# EAGLE design usbdmx (EAGLE 7.2.0)
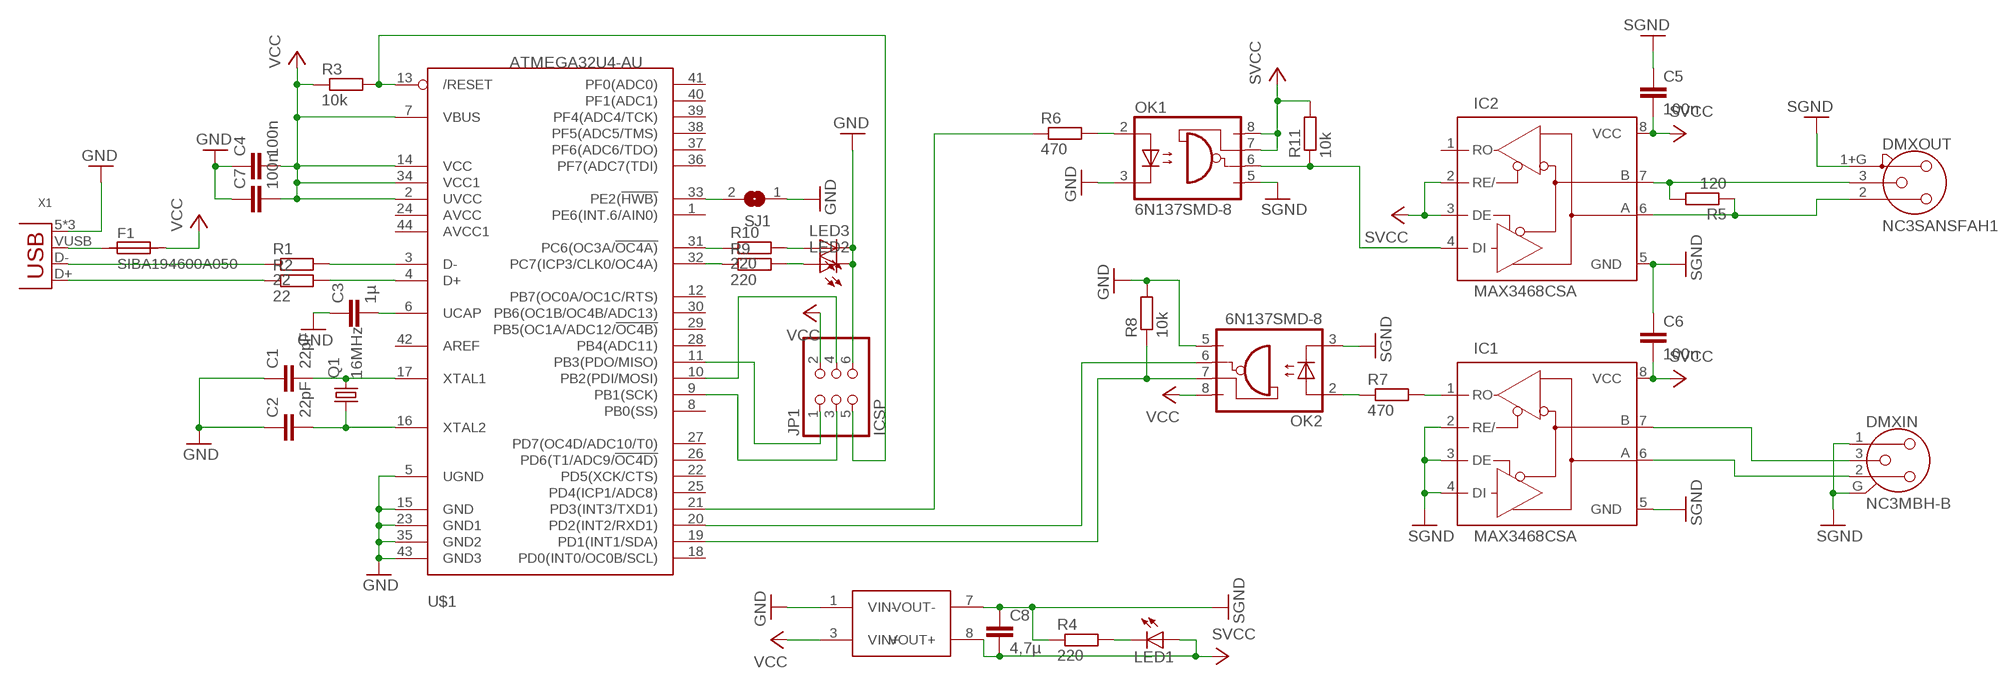
[diagram p0: schematic, sheet 1]

## Parts
C1  22pF  C-EUC0805  [C0805]
C2  22pF  C-EUC0805  [C0805]
C3  1µ  C-EUC0805  [C0805]
C4  100n  C-EUC0805  [C0805]
C5  100n  C-EUC0805  [C0805]
C6  100n  C-EUC0805  [C0805]
C7  100n  C-EUC0805  [C0805]
C8  4,7µ  C-EUC0805  [C0805]
DMXIN  NC3MBH-B  [NC3MBH-B]
DMXOUT  NC3SANSFAH1  [NC3FAH1]
F1  SIBA194600A050  [1820]
IC1  MAX3468CSA  [SO08]
IC2  MAX3468CSA  [SO08]
JP1  ICSP  PINHD-2X3_2.54-SMD  [2X03SMD]
LED1  LEDSML0603  [SML0603]
LED2  LEDSML0603  [SML0603]
LED3  LEDSML0603  [SML0603]
OK1  6N137SMD-8  [SMD8]
OK2  6N137SMD-8  [SMD8]
Q1  16MHz  CRYSTALMT  [MT]
R1  22  R-EU_R0805  [R0805]
R2  22  R-EU_R0805  [R0805]
R3  10k  R-EU_R0805  [R0805]
R4  220  R-EU_R0805  [R0805]
R5  120  R-EU_R0805  [R0805]
R6  470  R-EU_R0805  [R0805]
R7  470  R-EU_R0805  [R0805]
R8  10k  R-EU_R0805  [R0805]
R9  220  R-EU_R0805  [R0805]
R10  220  R-EU_R0805  [R0805]
R11  10k  R-EU_R0805  [R0805]
SJ1  SJ  [SJ]
U$1  ATMEGA32U4-AU  [TQFP44]
U$2  NTE0505SNTE0505MEC  [SMT]
X1  USB-B-S-R  [USB-B-SMT-R]

## Nets
GND: C1.1 C2.1 C3.1 C4.1 C7.1 JP1.6 LED2.C LED3.C OK1.3(C) OK2.5(GND) R8.2 SJ1.1 U$1.5(UGND) U$1.15(GND) U$1.23(GND1) U$1.35(GND2) U$1.43(GND3) U$2.1(VIN-) X1.5(GND) X1.6(GND) X1.GND
N$1: C1.2 Q1.P3 U$1.17(XTAL1)
N$2: C2.2 Q1.P1 U$1.16(XTAL2)
N$3: R1.2 U$1.3(D-)
N$4: R2.2 U$1.4(D+)
N$5: R2.1 X1.D+
N$6: R1.1 X1.D-
N$7: F1.1 X1.VUSB(VBUS)
N$8: C3.2 U$1.6(UCAP)
N$9: JP1.5 R3.2 U$1.13(/RESET)
N$10: R6.1 U$1.21(PD3(INT3/TXD1))
N$11: LED1.C R4.2
N$12: DMXOUT.2 IC2.6(A) R5.1
N$13: JP1.1 U$1.11(PB3(PDO/MISO))
N$14: JP1.4 U$1.10(PB2(PDI/MOSI))
N$15: JP1.3 U$1.9(PB1(SCK))
N$16: OK2.7(VE) R8.1 U$1.19(PD1(INT1/SDA))
N$17: DMXOUT.3 IC2.7(B) R5.2
N$18: DMXIN.2 IC1.6(A)
N$19: SJ1.2 U$1.33(PE2(!HWB))
N$20: IC2.4(DI) OK1.6(VO) R11.1
N$21: IC1.1(RO) R7.2
N$22: LED3.A R10.2
N$23: OK2.2(A) R7.1
N$24: OK2.6(VO) U$1.20(PD2(INT2/RXD1))
N$25: OK1.2(A) R6.2
N$26: LED2.A R9.2
N$27: R9.1 U$1.32(PC7(ICP3/CLK0/OC4A))
N$28: R10.1 U$1.31(PC6(OC3A/!OC4A))
N$29: DMXIN.3 IC1.7(B)
SGND: C5.1 C6.1 C8.1 DMXIN.1 DMXIN.G DMXOUT.1+G IC1.2(RE/) IC1.3(DE) IC1.4(DI) IC1.5(GND) IC2.5(GND) OK1.5(GND) OK2.3(C) R4.1 U$2.7(VOUT-)
SVCC: C5.2 C6.2 C8.2 IC1.8(VCC) IC2.2(RE/) IC2.3(DE) IC2.8(VCC) LED1.A OK1.7(VE) OK1.8(VCC) R11.2 U$2.8(VOUT+)
VCC: C4.2 C7.2 F1.2 JP1.2 OK2.8(VCC) R3.1 U$1.2(UVCC) U$1.7(VBUS) U$1.14(VCC) U$1.34(VCC1) U$2.3(VIN+)
Unconnected: IC2.1(RO) Q1.P2(GND) Q1.P4(GND1) U$1.1(PE6(INT.6/AIN0)) U$1.8(PB0(SS)) U$1.12(PB7(OC0A/OC1C/RTS)) U$1.18(PD0(INT0/OC0B/SCL)) U$1.22(PD5(XCK/CTS)) U$1.24(AVCC) U$1.25(PD4(ICP1/ADC8)) U$1.26(PD6(T1/ADC9/!OC4D)) U$1.27(PD7(OC4D/ADC10/T0)) U$1.28(PB4(ADC11)) U$1.29(PB5(OC1A/ADC12/!OC4B)) U$1.30(PB6(OC1B/OC4B/ADC13)) U$1.36(PF7(ADC7(TDI)) U$1.37(PF6(ADC6/TDO)) U$1.38(PF5(ADC5/TMS)) U$1.39(PF4(ADC4/TCK)) U$1.40(PF1(ADC1)) U$1.41(PF0(ADC0)) U$1.42(AREF) U$1.44(AVCC1)

## Library data of the parts
C1-C8 = rcl:C-EU: CAPACITOR, European symbol
DMXIN = con-neutrik_ag:NC3: Neutrik Audio Connector XLR SERIES Stereo 1/4" jack Source: www.neutrik.com/; MPN: NC3MBH-B; OC_FARNELL: unknown; OC_NEWARK: 27B4288
DMXOUT = con-neutrik_ag:NC3SANS
F1 = _hhn_PtcFuses_Siba_r500:SIBA194600*: SIBA PTC-Fuses, Series 194600, 1812 (4.5 3.2)mm Source: www.siba.de/ Package: SMD 1812 (4.5 x 3.2)mm Technologies: SIBA194600Axxx xxx: Trip-Current * 10 mA Author: Dipl.-Ing. FH Rainer Bayer
IC1 IC2 = maxim:MAX34*: +5V, Fail-Safe, 40Mbps, Profibus RS-485/RS-422 Transceivers Source: MAX3465-MAX3469.pdf; MPN: MAX3468CSA+; OC_FARNELL: unknown; OC_NEWARK: 76K6721
JP1 = pinhead:PINHD-2X3: PIN HEADER
LED1-LED3 = led:LED: LED OSRAM: - CHIPLED LG R971, LG N971, LY N971, LG Q971, LY Q971, LO R971, LY R971 LH N974, LH R974 LS Q976, LO Q976, LY Q976 LO Q996 - Hyper CHIPLED LW Q18S LB Q993, LB Q99A, LB R99A - SideLED LS A670, LO A670, LY A670, LG A670, LP A670 LB A673, LV A673, LT A673, LW A673 LH A674 LY A675 LS A676, LA A676, LO A676, LY A676, LW A676 LS A679, LY A679, LG A679 - Hyper Micro SIDELED® LS Y876, LA Y876, LO Y876, LY Y876 LT Y87S - SmartLED LW L88C, LW L88S LB L89C, LB L89S, LG L890 LS L89K, LO L89K, LY L89K LS L896, LA L896, LO L896, LY L896 - TOPLED LS T670, LO T670, LY T670, LG T670, LP T670 LSG T670, LSP T670, LSY T670, LOP T670, LYG T670 LG T671, LOG T671, LSG T671 LB T673, LV T673, LT T673, LW T673 LH T674 LS T676, LA T676, LO T676, LY T676, LB T676, LH T676, LSB T676, LW T676 LB T67C, LV T67C, LT T67C, LS T67K, LO T67K, LY T67K, LW E67C LS E67B, LA E67B, LO E67B, LY E67B, LB E67C, LV E67C, LT E67C LW T67C LS T679, LY T679, LG T679 LS T770, LO T770, LY T770, LG T770, LP T770 LB T773, LV T773, LT T773, LW T773 LH T774 LS E675, LA E675, LY E675, LS T675 LS T776, LA T776, LO T776, LY T776, LB T776 LHGB T686 LT T68C, LB T68C - Hyper Mini TOPLED® LB M676 - Mini TOPLED Santana® LG M470 LS M47K, LO M47K, LY M47K Source: http://www.osram.convergy.de LUXEON: - LUMILED® LXK2-PW12-R00, LXK2-PW12-S00, LXK2-PW14-U00, LXK2-PW14-V00 LXK2-PM12-R00, LXK2-PM12-S00, LXK2-PM14-U00 LXK2-PE12-Q00, LXK2-PE12-R00, LXK2-PE12-S00, LXK2-PE14-T00, LXK2-PE14-U00 LXK2-PB12-K00, LXK2-PB12-L00, LXK2-PB12-M00, LXK2-PB14-N00, LXK2-PB14-P00, LXK2-PB14-Q00 LXK2-PR12-L00, LXK2-PR12-M00, LXK2-PR14-Q00, LXK2-PR14-R00 LXK2-PD12-Q00, LXK2-PD12-R00, LXK2-PD12-S00 LXK2-PH12-R00, LXK2-PH12-S00 LXK2-PL12-P00, LXK2-PL12-Q00, LXK2-PL12-R00 Source: www.luxeon.com KINGBRIGHT: KA-3528ASYC Source: www.kingbright.com
OK1 OK2 = optocoupler:6N137: MOTOROLA OPTO COUPLER
Q1 = Crystals-new:CRYSTAL
R1-R11 = rcl:R-EU_: RESISTOR, European symbol
SJ1 = jumper:SJ: SMD solder JUMPER
U$1 = adafruit:ATMEGA32U4: http://www.ladyada.net/library/eagle
U$2 = murata-dcdc:NTE0505S
X1 = con-usb-3:USB: USB Connectors

## Board
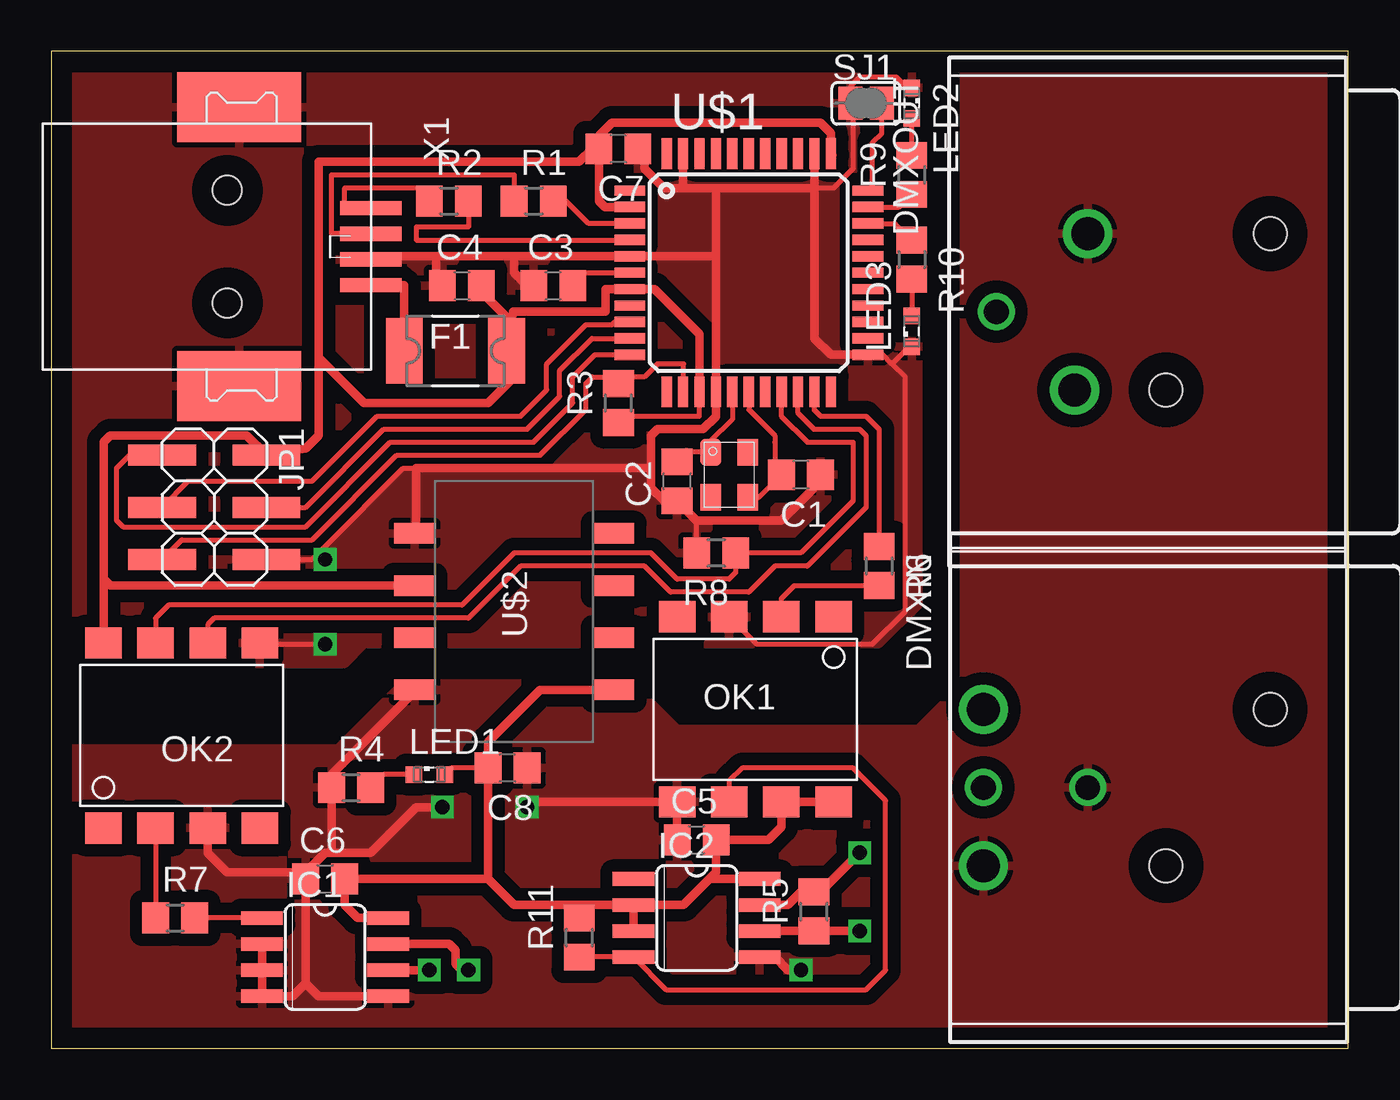
[diagram p1: board, top side]
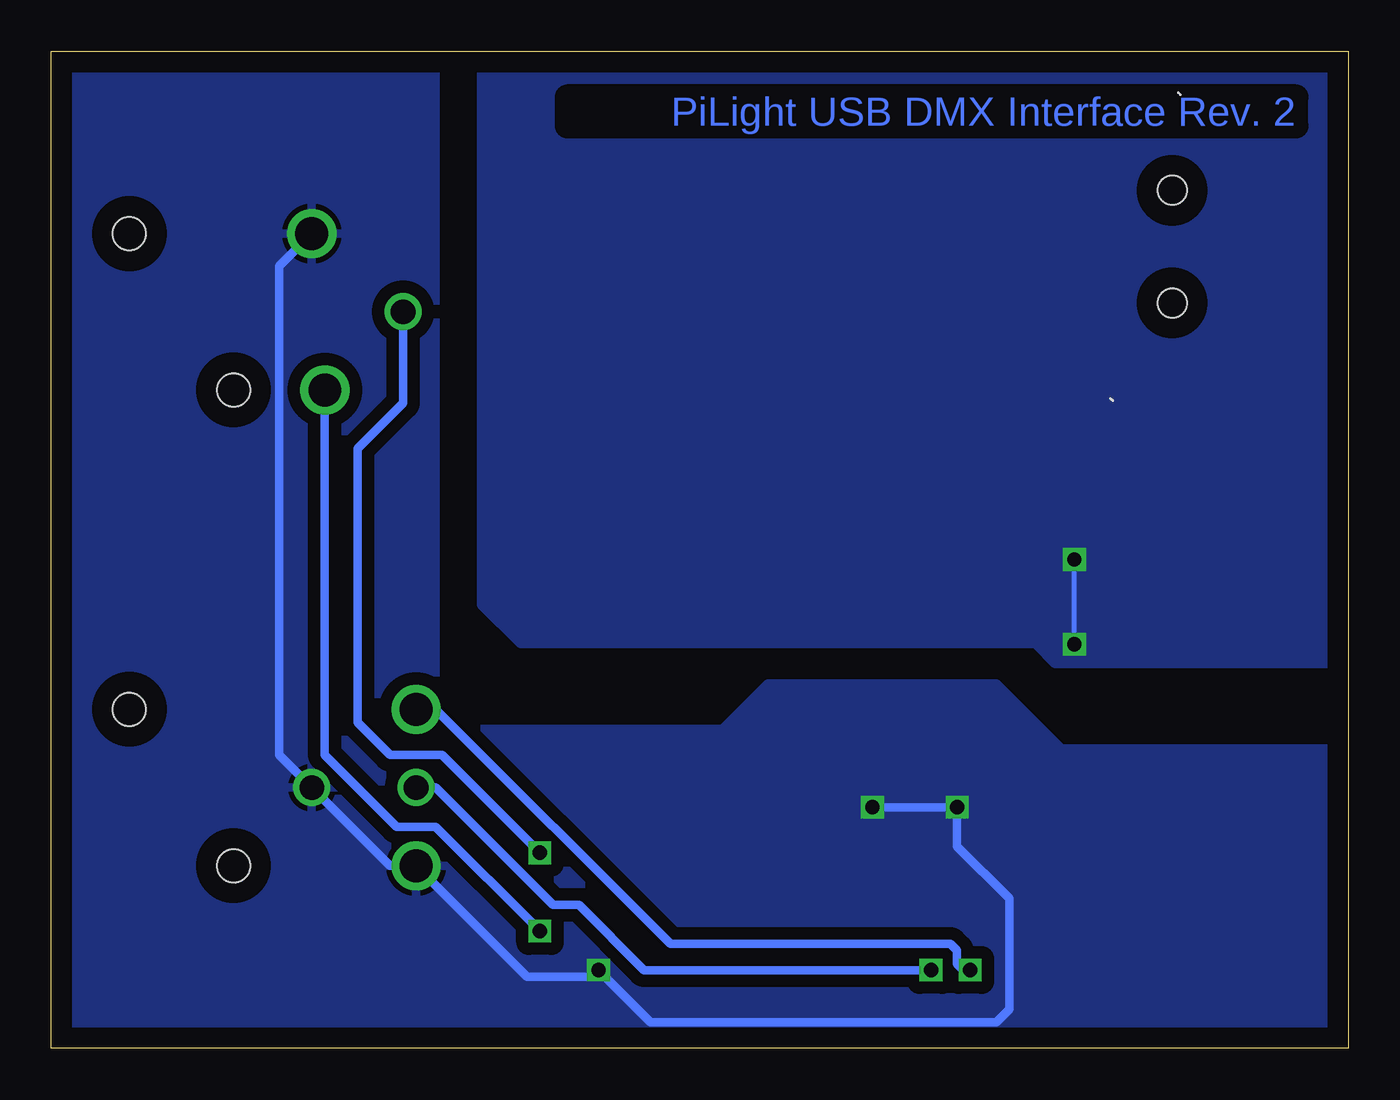
[diagram p2: board, bottom side, seen from below]

Size 63.17 x 48.57 mm. Coordinates in mm from the lower left corner, seen from the top.
Outline: 0,0 63.17,0 63.17,48.57 0,48.57 0,0
Copper layers (1*16): Top 0.035mm / dielectric 1.5mm / Bottom 0.035mm
Design rules "default": minimum track width 10mil, minimum drill 24mil, track to track 8mil, track to pad 8mil, pad to pad 8mil, via to via 8mil, smd to smd 8mil, copper to edge 40mil, drill to drill 8mil, minimum pad ring 10mil, minimum via ring 8mil, stop-mask expansion 4mil, vias tented up to drill 0mil, thermal gap 10mil

### Footprints (pad centres in the part's own frame; a part is rotated, then mirrored left to right if it is on the bottom)
C0805 = smd 1.3 x 1.5: 1 -0.95,0; 2 0.95,0
NC3MBH-B = drill 1.6: 1 3.81,0; 2 -3.81,0 | drill 1.2: 3 0,0; G 0,5.08 | hole 1.6: -3.81,13.97; 3.81,8.89
NC3FAH1 = drill 1.6: 1+G -3.81,0.635; 2 3.81,0 | drill 1.2: 3 0,-3.815 | hole 1.6: -3.81,9.525; 3.81,4.445
1820 = smd 1.78 x 3.2: 1 -2.49,0; 2 2.49,0
SO08 = smd 0.66 x 2.032: 1 -1.905,-3.073; 2 -0.635,-3.073; 3 0.635,-3.073; 4 1.905,-3.073; 5 1.905,3.073; 6 0.635,3.073; 7 -0.635,3.073; 8 -1.905,3.073
2X03SMD = smd 1.016 x 3.302: 1 -1.27,-3.81; 2 -1.27,1.27; 3 1.27,-3.81; 4 1.27,1.27; 5 3.81,-3.81; 6 3.81,1.27
SML0603 = smd 0.8 x 0.8: A 0.75,0; C -0.75,0
SMD8 = smd 1.524 x 1.778: 1 -4.508,3.81; 2 -4.508,1.27; 3 -4.508,-1.27; 4 -4.508,-3.81; 5 4.508,-3.81; 6 4.508,-1.27; 7 4.508,1.27; 8 4.508,3.81
MT = smd 1.3 x 1: P1 -1.1,-0.9; P2 1.1,-0.9; P3 1.1,0.9; P4 -1.1,0.9
R0805 = smd 1.3 x 1.5: 1 -0.95,0; 2 0.95,0
SJ = smd 1.168 x 1.6: 1 -0.762,0; 2 0.762,0
TQFP44 = smd 1.5 x 0.5: 1 -5.8,4; 2 -5.8,3.2; 3 -5.8,2.4; 4 -5.8,1.6; 5 -5.8,0.8; 6 -5.8,0; 7 -5.8,-0.8; 8 -5.8,-1.6; 9 -5.8,-2.4; 10 -5.8,-3.2; 11 -5.8,-4; 23 5.8,-4; 24 5.8,-3.2; 25 5.8,-2.4; 26 5.8,-1.6; 27 5.8,-0.8; 28 5.8,0; 29 5.8,0.8; 30 5.8,1.6; 31 5.8,2.4; 32 5.8,3.2; 33 5.8,4 | smd 0.5 x 1.5: 12 -4,-5.8; 13 -3.2,-5.8; 14 -2.4,-5.8; 15 -1.6,-5.8; 16 -0.8,-5.8; 17 0,-5.8; 18 0.8,-5.8; 19 1.6,-5.8; 20 2.4,-5.8; 21 3.2,-5.8; 22 4,-5.8; 34 4,5.8; 35 3.2,5.8; 36 2.4,5.8; 37 1.6,5.8; 38 0.8,5.8; 39 0,5.8; 40 -0.8,5.8; 41 -1.6,5.8; 42 -2.4,5.8; 43 -3.2,5.8; 44 -4,5.8
SMT = smd 2 x 1: 1 -4.85,3.81; 3 -4.85,1.27; 5 -4.85,-1.27; 7 -4.85,-3.81; 8 4.85,-3.81; 10 4.85,-1.27; 12 4.85,1.27; 14 4.85,3.81
USB-B-SMT-R = smd 6.04 x 3.4: 5 0.58,6.8; 6 0.58,-6.8 | smd 3 x 0.7: D+ 7,1.875; D- 7,0.625; GND 7,-0.625; VUSB 7,-1.875 | hole 1.4: 0,2.75; 0,-2.75

### Placement (x,y rotation side)
C1  36.51,27.94 180 top
C2  30.48,27.62 90 top
C3  24.45,37.15 0 top
C4  20,37.15 0 top
C5  31.43,10.16 0 top
C6  13.34,8.26 0 top
C7  27.62,43.81 180 top
C8  22.23,13.65 180 top
DMXIN  45.4,12.7 270 top
DMXOUT  49.85,35.88 270 top
F1  19.68,33.97 0 top
IC1  13.34,4.45 270 top
IC2  31.43,6.35 270 top
JP1  9.21,27.62 270 top
LED1  18.41,13.34 0 top
LED2  41.91,46.04 270 top
LED3  41.91,34.92 90 top
OK1  34.29,16.51 270 top
OK2  6.35,15.24 90 top
Q1  33.02,27.94 270 top
R1  23.5,41.27 0 top
R2  19.37,41.27 0 top
R3  27.62,31.43 90 top
R4  14.61,12.7 0 top
R5  37.15,6.67 90 top
R6  40.32,23.5 270 top
R7  6.03,6.35 0 top
R8  32.38,24.13 180 top
R9  41.91,42.55 90 top
R10  41.91,38.42 270 top
R11  25.72,5.4 90 top
SJ1  39.69,46.04 0 top
U$1  33.97,37.78 0 top
U$2  22.54,21.27 0 top
X1  8.57,39.05 0 top

### Tracks (layer width: path | path; a pad name or v marks a point on that pad's centre or on a via)
GND  (via drill 0.7)
  Top 0.254: JP1.6 12.7,23.81 13.34,24.45 | 13.34,24.45 17.14,28.26 17.78,28.26 | R8.2 31.43,25.72 | 40.96,33.34 41.59,32.7 41.59,21.27 40.01,19.68 34.35,19.68 OK1.3 | 40.96,33.34 40.51,33.78 U$1.23 | 37.17,41.91 38.1,41.91 39.05,42.86 39.05,45.91 SJ1.1 38.92,46.86 39.37,47.31 41.16,47.31 41.8,46.67 LED2.C | LED3.C 41.8,34.17 40.96,33.34 | 10.16,19.68 v13.34,19.68 | v13.34,23.81 13.34,24.45
  Top 0.406: 32.37,38.58 U$1.15 32.37,30.79 31.75,30.16 29.53,30.16 29.21,29.84 29.21,28.26 | 32.37,38.58 U$1.5 22.54,38.58 | 32.37,38.58 32.37,41.91 | 32.37,41.91 30.77,41.91 | U$1.43 30.77,41.91 | 32.37,41.91 37.17,41.91 | 37.17,41.91 U$1.35 | X1.GND 15.73,38.58 18.73,38.58 | 18.73,38.58 22.54,38.58 | C4.1 18.73,37.15 18.73,38.58 | 22.54,38.58 22.54,37.78 23.18,37.15 C3.1 | 37.17,41.91 37.17,34.58 37.97,33.78 U$1.23 | C7.1 28.89,43.49 28.89,42.86 29.84,41.91 30.77,41.91 | 37.46,28.26 C1.1 37.15,27.62 37.15,27.3 35.56,25.72 31.43,25.72 C2.1 | C2.1 | 29.21,28.26 29.21,27.3 29.84,26.67 C2.1 | 29.21,28.26 17.78,28.26 17.78,25.4 U$2.1 | OK2.5 10.16,19.68
  Bottom 0.254: v13.34,19.68 v13.34,23.81
  pour Top (isolate 0.61): 0.64,47.62 0.64,18.73 14.29,18.73 15.24,19.68 40.32,19.68 42.23,21.59 42.23,47.62
  pour Bottom (isolate 0.61): 0.95,47.62 42.23,47.62 42.23,21.59 40.32,19.68 15.24,19.68 14.29,18.73 0.95,18.73
N$1
  Top 0.254: U$1.17 33.97,31.11 35.24,29.84 35.24,29.52 35.24,28.57 35.56,28.25 | Q1.P3 34.46,26.84 C1.2
  Top 0.406: 35.56,28.25 C1.2
N$2
  Top 0.254: U$1.16 33.17,30.63 32.12,29.58 Q1.P1 30.95,29.04
  Top 0.406: 30.95,29.04 C2.2
N$3
  Top 0.254: U$1.3 26.18,40.18 25.08,41.27 R1.2
N$4
  Top 0.254: U$1.4 17.78,39.37 17.78,40.01 20.32,40.01 R2.2
  Top 0.406: U$1.4
N$5
  Top 0.254: X1.D+ 14.29,40.93 14.29,41.91 18.41,41.91 R2.1
  Top 0.406: R2.1
N$6
  Top 0.254: X1.D- 13.65,39.69 13.65,42.55 22.55,42.55 R1.1
  Top 0.406: X1.D-
N$7
  Top 0.406: X1.VUSB 17.2,37.18 F1.1
N$8
  Top 0.254: C3.2 26.03,37.78 U$1.6
N$9
  Top 0.254: 30.8,32.01 30.8,33.34 29.53,33.34 28.89,32.7 27.94,32.7 R3.2 27.3,32.7 26.35,32.7 26.04,32.38 26.04,31.11 23.81,28.89 16.83,28.89 12.7,24.77 6.35,24.77 JP1.5
  Top 0.406: U$1.13 30.8,32.01
N$10
  Top 0.254: U$1.21 37.17,31.09 37.47,30.8 39.69,30.8 40.32,30.16 R6.1
N$11
  Top 0.254: LED1.C 16.19,13.34 R4.2
N$12  (via drill 0.7)
  Top 0.406: IC2.6 R5.1 v39.37,5.71
  Bottom 0.406: DMXOUT.2 49.85,14.29 46.35,10.79 44.45,10.79 v39.37,5.71
N$13
  Top 0.254: JP1.1 3.81,28.89 3.17,28.26 3.17,25.72 3.49,25.4 12.38,25.4 16.51,29.53 23.5,29.53 25.4,31.43 25.4,32.7 26.48,33.78 U$1.11
N$14
  Top 0.254: 27.65,34.58 27.62,34.61 | 11.11,26.35 12.38,26.35 16.19,30.16 23.18,30.16 24.77,31.75 24.77,33.02 26.33,34.58 U$1.10
  Top 0.406: U$1.10 27.65,34.58 | JP1.4 10.79,26.67 11.11,26.35
N$15
  Top 0.254: U$1.9 27.45,35.38 27.3,35.24 26.04,35.24 24.13,33.34 24.13,32.07 22.86,30.8 15.88,30.8 12.7,27.62 6.67,27.62 JP1.3
N$16
  Top 0.254: U$1.19 35.57,30.79 36.83,29.53 39.05,29.53 39.05,26.67 36.51,24.13 R8.1 33.34,23.18 33.02,22.86 30.48,22.86 29.21,24.13 22.54,24.13 20,21.59 5.71,21.59 5.08,20.95 OK2.7
N$17  (via drill 0.7)
  Top 0.406: IC2.7 35.88,6.99 36.51,7.62 R5.2 37.46,7.62 v39.37,9.53
  Bottom 0.406: DMXOUT.3 46.03,31.44 48.26,29.21 48.26,15.88 46.67,14.29 44.13,14.29 v39.37,9.53
N$18  (via drill 0.7)
  Top 0.406: IC1.6 v18.41,3.81
  Bottom 0.406: DMXIN.2 44.45,16.51 33.02,5.08 19.37,5.08 19.05,4.76 19.05,4.13 18.73,3.81 v18.41,3.81
N$19
  Top 0.254: U$1.33 40.01,42.02 40.01,44.13 40.45,44.58 SJ1.2
N$20
  Top 0.254: OK1.6 33.02,13.02 33.66,13.65 39.05,13.65 40.64,12.06 40.64,3.81 39.69,2.86 29.95,2.86 IC2.4 R11.1
N$21
  Top 0.254: IC1.1 R7.2
N$22
  Top 0.254: R10.2 LED3.A
N$23
  Top 0.254: OK2.2 R7.1
N$24
  Top 0.254: U$1.20 36.37,30.94 37.15,30.16 39.37,30.16 39.69,29.84 39.69,26.35 36.83,23.5 35.24,23.5 33.97,22.23 30.16,22.23 28.89,23.5 22.86,23.5 20.32,20.95 7.94,20.95 7.62,20.64 OK2.6
N$25
  Top 0.254: OK1.2 35.56,21.91 36.2,22.54 R6.2
N$26
  Top 0.254: R9.2 LED2.A
N$27
  Top 0.254: U$1.32 41.3,40.98 R9.1
N$28
  Top 0.254: U$1.31 41.09,40.18 R10.1
N$29  (via drill 0.7)
  Top 0.406: IC1.7 19.37,5.08 19.68,4.76 19.68,4.13 20,3.81 v20.32,3.81
  Bottom 0.406: v20.32,3.81 34.29,3.81 37.47,6.99 38.73,6.99 44.45,12.7 DMXIN.3
SGND  (via drill 0.7)
  Top 0.406: IC1.2 IC1.3 IC1.4 11.75,2.54 12.38,3.18 | OK2.3 7.62,9.53 8.57,8.57 12.38,8.57 | C5.1 OK1.5 23.43,12 v23.18,11.75 | IC2.5 35.24,4.45 35.88,3.81 v36.51,3.81 | 12.38,8.57 C6.1 12.38,3.18 | 12.38,8.57 13.34,9.53 13.65,9.53 | 13.65,9.53 15.56,9.53 17.78,11.74 v19.05,11.74 | IC1.5 13.02,2.54 12.38,3.18 | 13.65,9.53 R4.1 13.65,13.34 17.69,17.38 U$2.7
  Bottom 0.406: DMXOUT.1+G 52.07,38.1 52.07,14.29 DMXIN.G 46.67,8.89 DMXIN.1 40.01,3.49 36.83,3.49 v36.51,3.81 33.97,1.27 17.14,1.27 16.51,1.91 16.51,7.3 19.05,9.84 v19.05,11.74 v19.05,11.75 v23.18,11.75
  pour Top (isolate 0.61): 0.64,0.64 62.55,0.64 62.55,47.62 44.45,47.62 44.45,17.78 42.23,15.56 30.48,15.56 28.26,17.78 17.14,17.78 13.97,14.61 0.64,14.61
  pour Bottom (isolate 0.61): 0.95,0.64 62.55,0.64 62.55,47.62 44.45,47.62 44.45,17.78 42.23,15.56 30.48,15.56 28.26,17.78 17.14,17.78 13.97,14.61 0.95,14.61
SVCC
  Top 0.254: R11.2 25.4,6.67 25.4,6.99 | C8.2 19.48,13.65 LED1.A
  Top 0.406: IC2.2 IC2.3 | 36.2,12 OK1.7 | 35.88,11.69 OK1.7 | 36.09,11.9 36.2,12 | IC2.2 30.8,6.99 32.07,8.26 | 32.07,8.26 IC2.8 | 32.07,8.26 32.38,8.57 C5.2 34.92,10.16 35.56,10.79 OK1.7 | 21.27,8.26 C6.2 14.29,6.99 14.92,6.35 IC1.8 | IC2.2 25.4,6.99 22.55,6.99 21.27,8.26 | 36.2,12 OK1.8 | U$2.8 23.81,17.46 21.27,14.92 C8.2 21.27,8.26
VCC
  Top 0.254: R3.1 27.62,30.8 31.57,30.8 U$1.14
  Top 0.406: F1.2 22.49,35.88 26.99,35.88 26.99,36.98 U$1.7 29.38,36.98 31.57,34.78 U$1.14 | 22.49,32.65 22.49,33.34 F1.2 | U$1.2 26.96,40.98 26.67,41.27 C7.2 | C4.2 21.27,36.83 21.27,36.51 22.49,35.29 F1.2 | 38.06,43.5 U$1.34 37.97,44.58 37.47,45.09 27.3,45.09 26.67,44.45 C7.2 | F1.2 22.54,33.92 22.54,32.7 21.27,31.43 15.24,31.43 13.02,33.66 | 22.54,33.6 F1.2 | 13.02,33.66 13.02,43.18 25.72,43.18 26.35,43.81 C7.2 | 13.02,33.66 13.02,29.84 12.38,29.21 JP1.2 9.53,29.84 2.86,29.84 2.54,29.53 2.54,22.86 | U$2.3 2.86,22.54 2.54,22.86 | OK2.8 2.54,22.86

### Text on the board
Bottom: PiLight USB DMX Interface Rev. 2